# Altium schematic sheet Traiak.SchDoc
size A
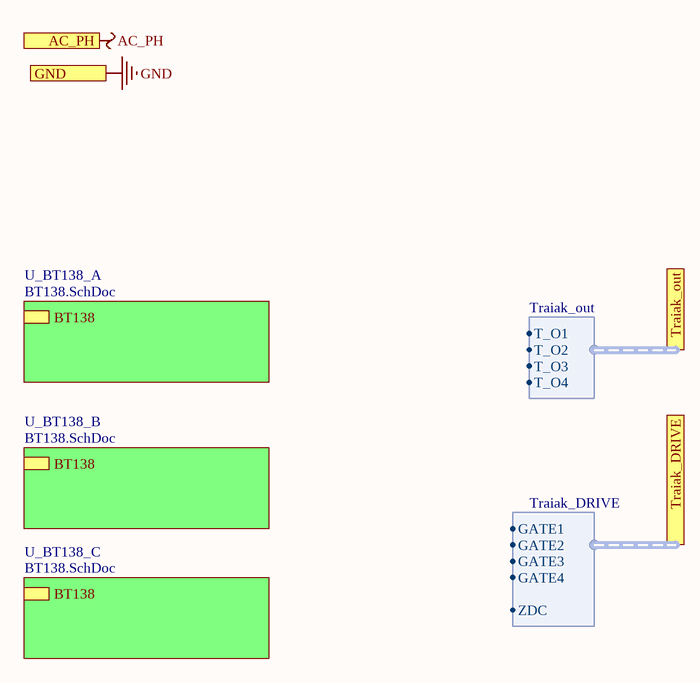
[diagram p0: Traiak.SchDoc]

## Sub-sheets
U_BT138_A = BT138.SchDoc: BT138 (harness BT138)
U_BT138_B = BT138.SchDoc: BT138 (harness BT138)
U_BT138_C = BT138.SchDoc: BT138 (harness BT138)

## Ports
AC_PH (in), GND (in), Traiak_DRIVE (harness Traiak_DRIVE), Traiak_out (harness Traiak_out)

## Harnesses
Traiak_out: T_O1, T_O2, T_O3, T_O4
Traiak_DRIVE: GATE1, GATE2, GATE3, GATE4, ZDC

## Nets
AC_PH: port AC_PH
GND: port GND